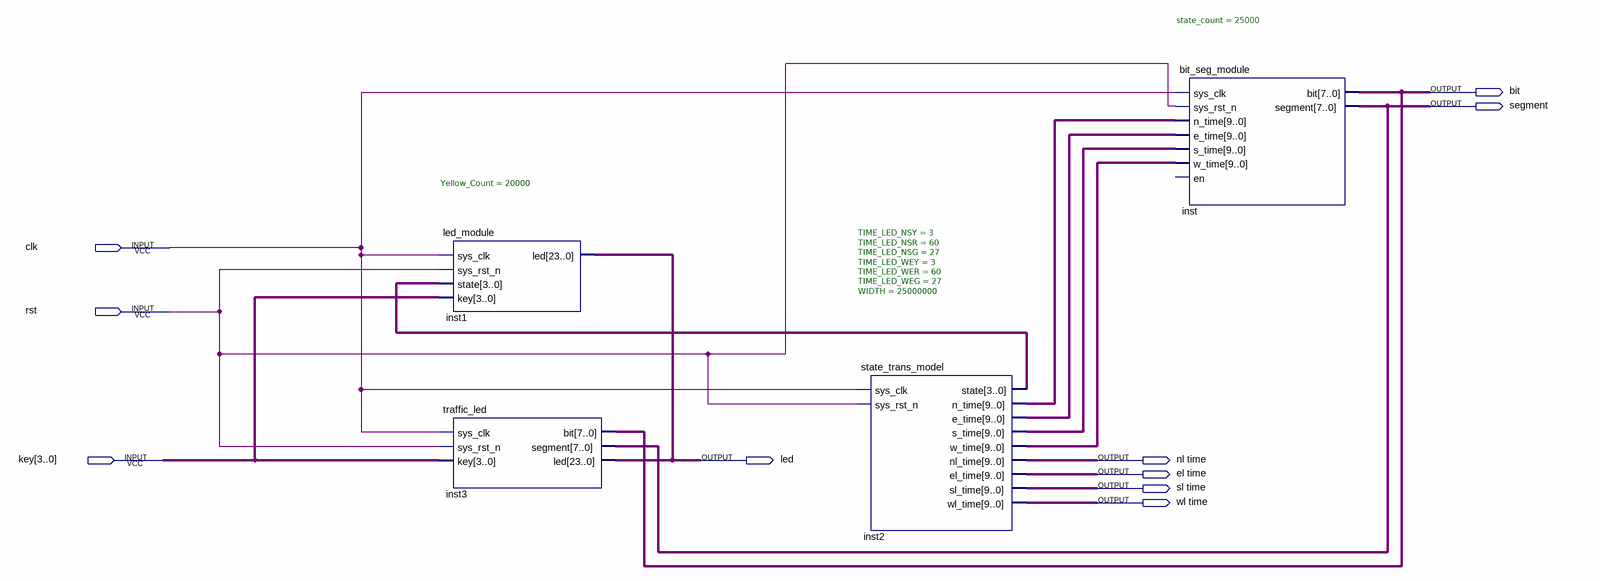
[diagram p0: schematic sheet]
// Quartus schematic traffic_led.bdf as structural Verilog: 4 symbols, 10 pins
module traffic_led (
  input  clk,
  input  rst,
  input  [3:0] key,
  output \bit ,
  output segment,
  output led,
  output \nl_time ,
  output \el_time ,
  output \sl_time ,
  output \wl_time 
);

  wire [3:0] inst2_state;
  wire [7:0] inst3_bit, inst3_segment;
  wire [9:0] inst2_e_time, inst2_el_time, inst2_n_time, inst2_nl_time, inst2_s_time, inst2_sl_time,
       inst2_w_time, inst2_wl_time;
  wire [23:0] inst1_led;

  led_module #(.Yellow_Count(20000)) inst1 (
    .sys_clk(clk), .sys_rst_n(rst), .state(inst2_state), .key(key), .led(inst1_led));
  traffic_led inst3 (
    .sys_clk(clk), .sys_rst_n(rst), .key(key), .\bit (inst3_bit), .segment(inst3_segment), .led(inst1_led));
  state_trans_model #(.TIME_LED_NSY(3), .TIME_LED_NSR(60), .TIME_LED_NSG(27), .TIME_LED_WEY(3), .TIME_LED_WER(60), .TIME_LED_WEG(27), .WIDTH(25000000)) inst2 (
    .sys_clk(clk), .sys_rst_n(rst), .state(inst2_state), .n_time(inst2_n_time), .e_time(inst2_e_time),
    .s_time(inst2_s_time), .w_time(inst2_w_time), .nl_time(inst2_nl_time), .el_time(inst2_el_time),
    .sl_time(inst2_sl_time), .wl_time(inst2_wl_time));
  bit_seg_module #(.state_count(25000)) inst (
    .sys_clk(clk), .sys_rst_n(rst), .n_time(inst2_n_time), .e_time(inst2_e_time), .s_time(inst2_s_time),
    .w_time(inst2_w_time), .\bit (inst3_bit), .segment(inst3_segment));  // open: en
endmodule
